# Altium schematic sheet MB1641_TOP.SchDoc: MB1641 Top
size A4; Date: Not used; ApprovedBy: Not used; CheckedBy: Not used; Author: Not used; CompanyName: STMicroelectronics; DrawnBy: Not used; Engineer: Not used; Organization: Not used; Address1: Not used; Address2: Not used; Address3: Not used; Address4: Not used; DocumentNumber: Not used; Revision: Not used; SheetNumber: 2; SheetTotal: 8; CurrentTime: Not used; CurrentDate: Not used; Time: Not used; DocumentFullPathAndName: Not used; DocumentName: Not used; ModifiedDate: Not used; ImagePath: Not used; ProjectName: Not used; Application_BuildNumber: Not used
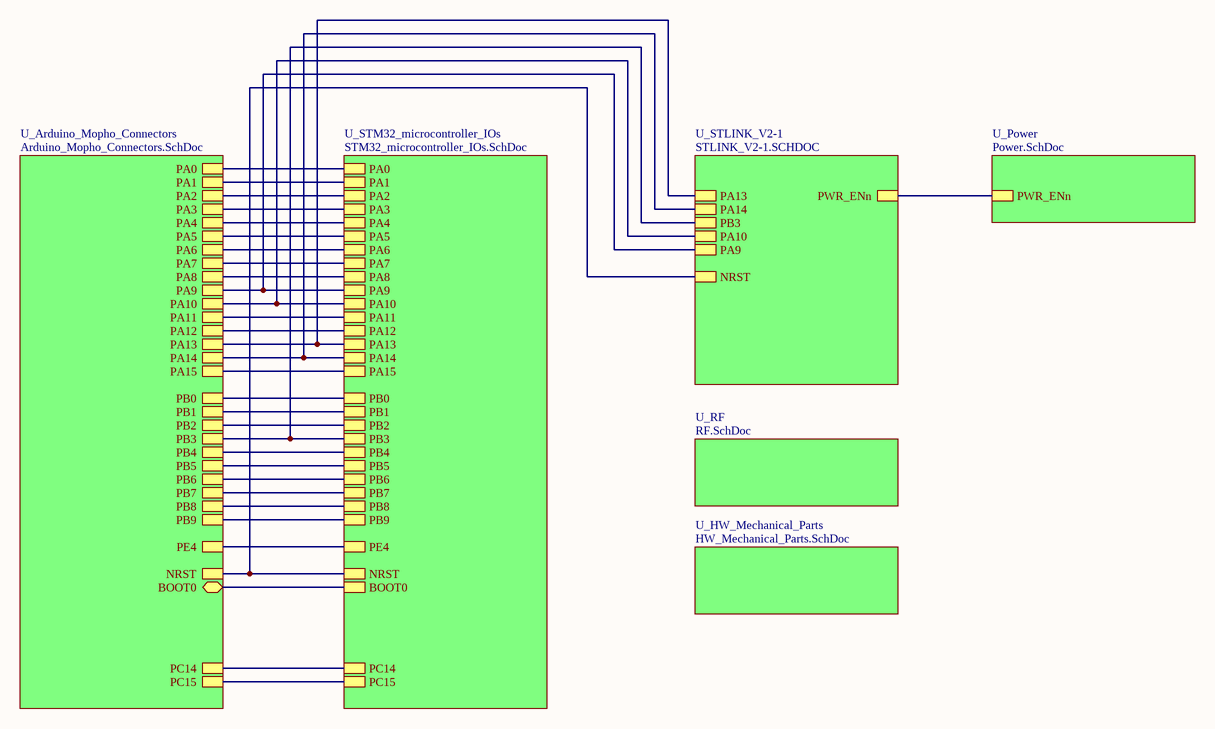
[diagram p0: MB1641_TOP.SchDoc]

## Sub-sheets
U_Arduino_Mopho_Connectors = Arduino_Mopho_Connectors.SchDoc: NRST, BOOT0 (bidir), PC14, PC15, PB4, PB8, PB9, PA4, PA9, PA3, PA2, PA0, PA5, PA6, PA7, PA8, PA15, PB0, PA10, PE4, PB1, PB5, PA11, PA12, PA13, PA14, PB2, PB3, PB6, PB7, PA1
U_HW_Mechanical_Parts = HW_Mechanical_Parts.SchDoc: no entries
U_Power = Power.SchDoc: PWR_ENn
U_RF = RF.SchDoc: no entries
U_STLINK_V2-1 = STLINK_V2-1.SCHDOC: NRST, PA13, PA14, PB3, PWR_ENn, PA10, PA9
U_STM32_microcontroller_IOs = STM32_microcontroller_IOs.SchDoc: PA13, PA14, PA15, PB3, PB4, PA11, PA12, PA0, PA1, PA2, PA3, PA4, PA5, PA6, PA7, PA8, PA9, PA10, PB2, PB5, PB6, PB7, PB8, PB9, NRST, BOOT0, PC14, PC15, PB1, PB0, PE4

## Nets
(unnamed): sheet U_Power/PWR_ENn, sheet U_STLINK_V2-1/PWR_ENn
(unnamed): sheet U_STLINK_V2-1/NRST, sheet U_Arduino_Mopho_Connectors/NRST, sheet U_STM32_microcontroller_IOs/NRST
(unnamed): sheet U_STLINK_V2-1/PA13, sheet U_Arduino_Mopho_Connectors/PA13, sheet U_STM32_microcontroller_IOs/PA13
(unnamed): sheet U_STLINK_V2-1/PA14, sheet U_Arduino_Mopho_Connectors/PA14, sheet U_STM32_microcontroller_IOs/PA14
(unnamed): sheet U_STLINK_V2-1/PB3, sheet U_Arduino_Mopho_Connectors/PB3, sheet U_STM32_microcontroller_IOs/PB3
(unnamed): sheet U_STLINK_V2-1/PA10, sheet U_Arduino_Mopho_Connectors/PA10, sheet U_STM32_microcontroller_IOs/PA10
(unnamed): sheet U_STLINK_V2-1/PA9, sheet U_Arduino_Mopho_Connectors/PA9, sheet U_STM32_microcontroller_IOs/PA9
(unnamed): sheet U_Arduino_Mopho_Connectors/BOOT0, sheet U_STM32_microcontroller_IOs/BOOT0
(unnamed): sheet U_Arduino_Mopho_Connectors/PC14, sheet U_STM32_microcontroller_IOs/PC14
(unnamed): sheet U_Arduino_Mopho_Connectors/PC15, sheet U_STM32_microcontroller_IOs/PC15
(unnamed): sheet U_Arduino_Mopho_Connectors/PB4, sheet U_STM32_microcontroller_IOs/PB4
(unnamed): sheet U_Arduino_Mopho_Connectors/PB8, sheet U_STM32_microcontroller_IOs/PB8
(unnamed): sheet U_Arduino_Mopho_Connectors/PB9, sheet U_STM32_microcontroller_IOs/PB9
(unnamed): sheet U_Arduino_Mopho_Connectors/PA4, sheet U_STM32_microcontroller_IOs/PA4
(unnamed): sheet U_Arduino_Mopho_Connectors/PA3, sheet U_STM32_microcontroller_IOs/PA3
(unnamed): sheet U_Arduino_Mopho_Connectors/PA2, sheet U_STM32_microcontroller_IOs/PA2
(unnamed): sheet U_Arduino_Mopho_Connectors/PA0, sheet U_STM32_microcontroller_IOs/PA0
(unnamed): sheet U_Arduino_Mopho_Connectors/PA5, sheet U_STM32_microcontroller_IOs/PA5
(unnamed): sheet U_Arduino_Mopho_Connectors/PA6, sheet U_STM32_microcontroller_IOs/PA6
(unnamed): sheet U_Arduino_Mopho_Connectors/PA7, sheet U_STM32_microcontroller_IOs/PA7
(unnamed): sheet U_Arduino_Mopho_Connectors/PA8, sheet U_STM32_microcontroller_IOs/PA8
(unnamed): sheet U_Arduino_Mopho_Connectors/PA15, sheet U_STM32_microcontroller_IOs/PA15
(unnamed): sheet U_Arduino_Mopho_Connectors/PB0, sheet U_STM32_microcontroller_IOs/PB0
(unnamed): sheet U_Arduino_Mopho_Connectors/PE4, sheet U_STM32_microcontroller_IOs/PE4
(unnamed): sheet U_Arduino_Mopho_Connectors/PB1, sheet U_STM32_microcontroller_IOs/PB1
(unnamed): sheet U_Arduino_Mopho_Connectors/PB5, sheet U_STM32_microcontroller_IOs/PB5
(unnamed): sheet U_Arduino_Mopho_Connectors/PA11, sheet U_STM32_microcontroller_IOs/PA11
(unnamed): sheet U_Arduino_Mopho_Connectors/PA12, sheet U_STM32_microcontroller_IOs/PA12
(unnamed): sheet U_Arduino_Mopho_Connectors/PB2, sheet U_STM32_microcontroller_IOs/PB2
(unnamed): sheet U_Arduino_Mopho_Connectors/PB6, sheet U_STM32_microcontroller_IOs/PB6
(unnamed): sheet U_Arduino_Mopho_Connectors/PB7, sheet U_STM32_microcontroller_IOs/PB7
(unnamed): sheet U_Arduino_Mopho_Connectors/PA1, sheet U_STM32_microcontroller_IOs/PA1

## Notes on the sheet
- Title:
- Project:
- Size:
- Revision:
- Variant:
- A4
- -
- Date:
- Reference:
- Sheet:
- of